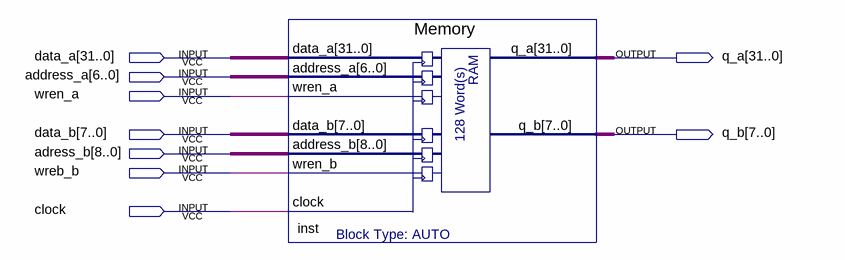
[diagram p0: schematic sheet]
// Quartus schematic memoria_RAM.bdf as structural Verilog: 1 symbols, 9 pins
module memoria_RAM (
  input  [31:0] data_a,
  input  [6:0] address_a,
  input  wren_a,
  input  [7:0] data_b,
  input  [8:0] adress_b,
  input  wreb_b,
  input  clock,
  output [31:0] q_a,
  output [7:0] q_b
);

  Memory inst (
    .data_a(data_a), .address_a(address_a), .wren_a(wren_a), .data_b(data_b), .address_b(adress_b),
    .wren_b(wreb_b), .clock(clock), .q_a(q_a), .q_b(q_b));
endmodule
